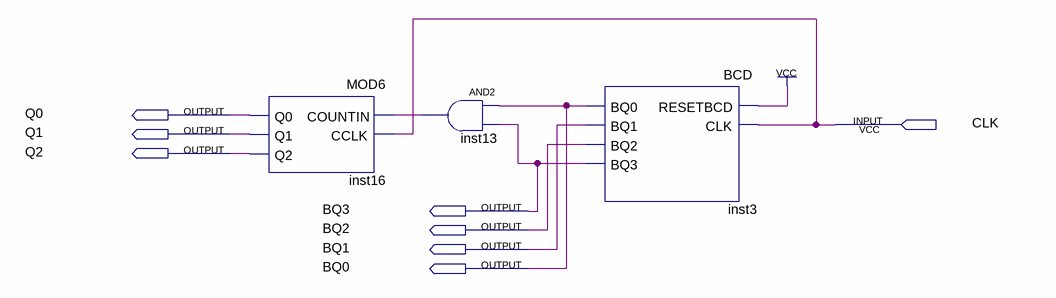
[diagram p0: schematic sheet]
// Quartus schematic MOD60.bdf as structural Verilog: 3 symbols, 8 pins
module MOD60 (
  input  CLK,
  output Q0,
  output Q1,
  output Q2,
  output BQ3,
  output BQ2,
  output BQ1,
  output BQ0
);

  wire inst13_out;

  MOD6 inst16 (.COUNTIN(inst13_out), .CCLK(CLK), .Q0(Q0), .Q1(Q1), .Q2(Q2));
  and inst13 (inst13_out, BQ0, BQ3);
  BCD inst3 (.RESETBCD(1'b1), .CLK(CLK), .BQ0(BQ0), .BQ1(BQ1), .BQ2(BQ2), .BQ3(BQ3));
endmodule
